# EAGLE design max660-inverter (EAGLE 7.1.0)
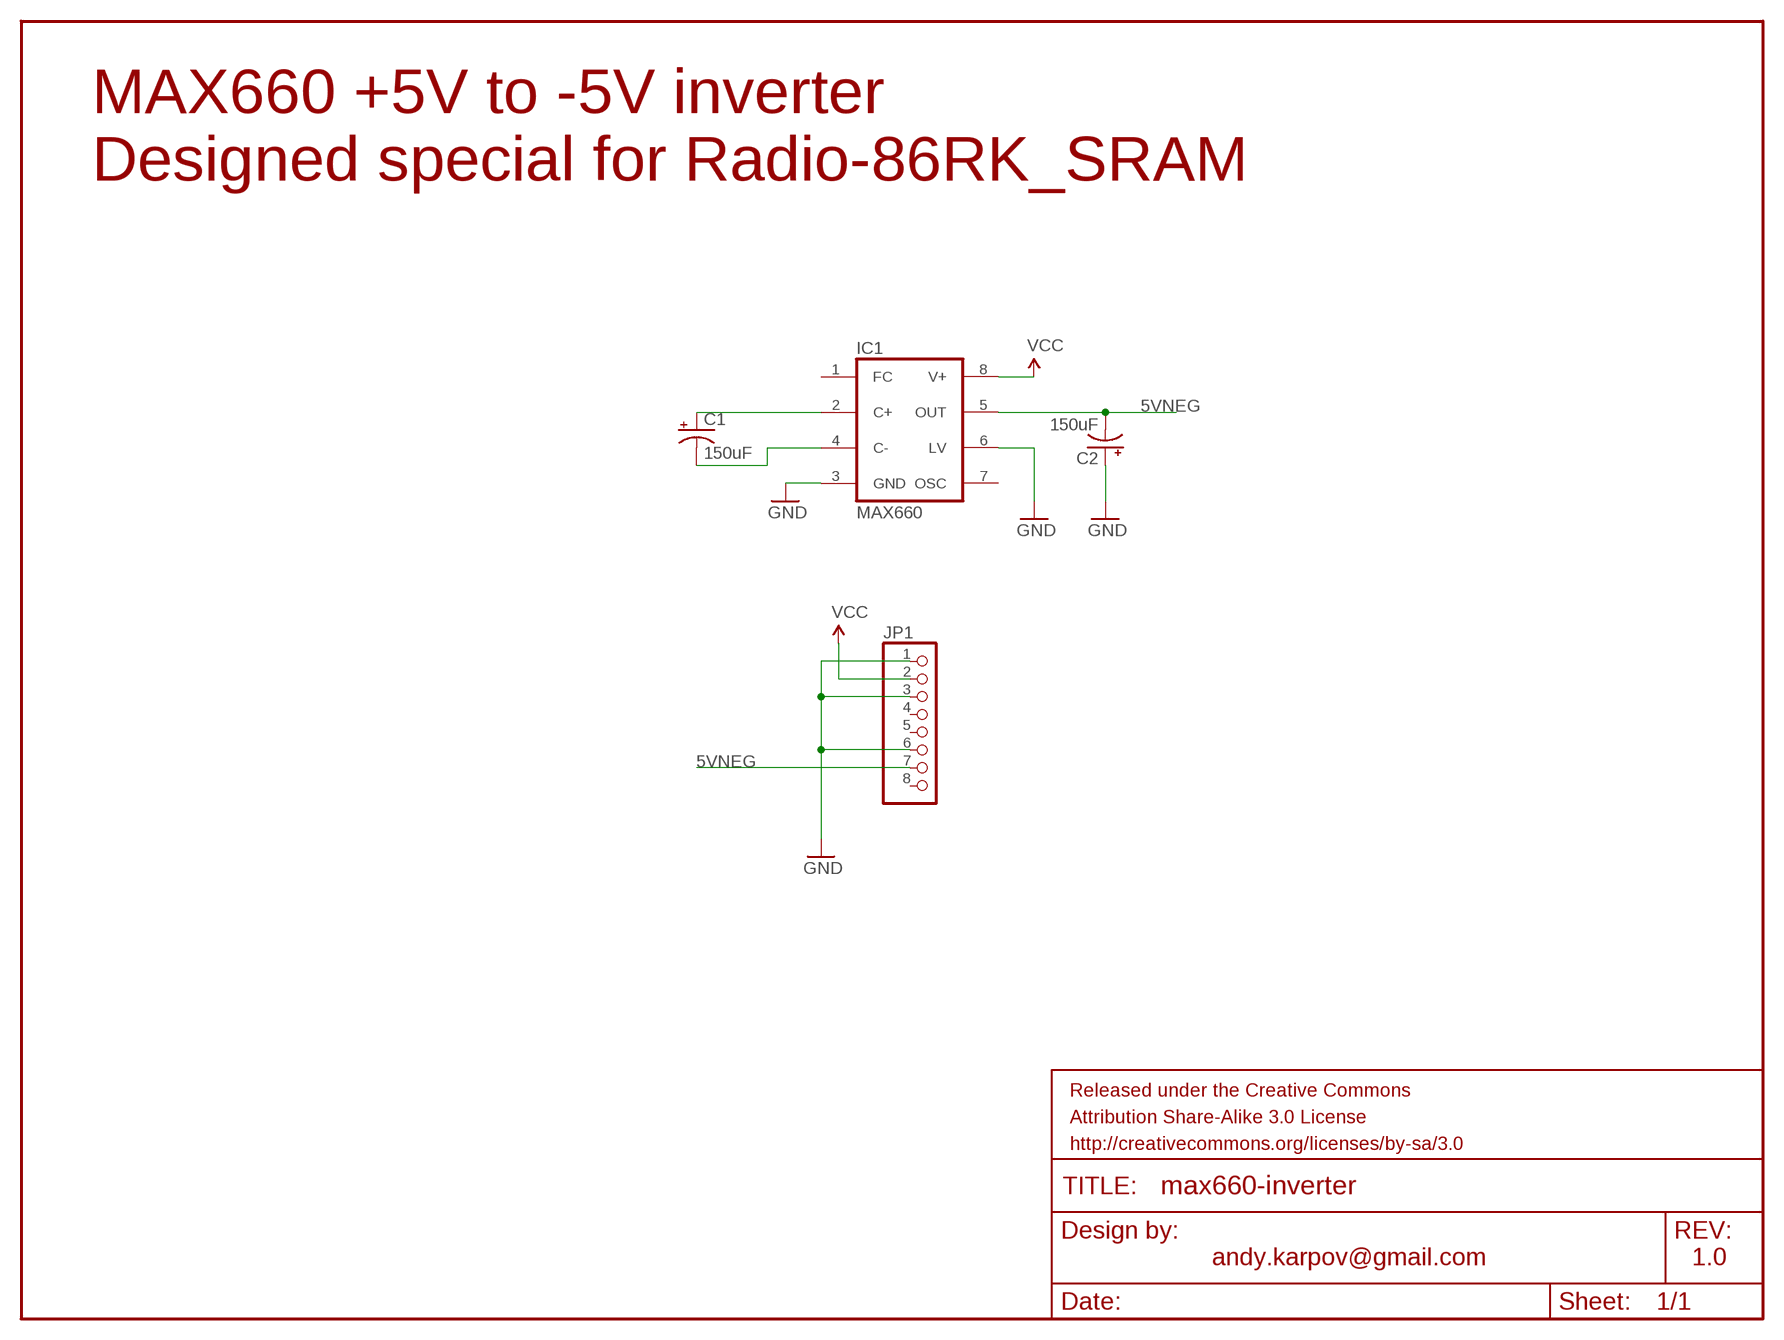
[diagram p0: schematic, sheet 1]

## Parts
C1  150uF  CAP_POLD  [PANASONIC_D]
C2  150uF  CAP_POLD  [PANASONIC_D]
FRAME1  FRAME-LETTER  [CREATIVE_COMMONS]
IC1  MAX660  MAX660CSA  [SO08]
JP1  PINHD-1X8  [1X08]

## Nets
5VNEG: C2.- IC1.5(OUT) JP1.7
GND: C2.+ IC1.3(GND) IC1.6(LV) JP1.1 JP1.3 JP1.6
N$1: C1.- IC1.4(C-)
N$2: C1.+ IC1.2(C+)
VCC: IC1.8(V+) JP1.2
Unconnected: IC1.1(FC) IC1.7(OSC) JP1.4 JP1.5 JP1.8

## Notes on the sheet
- MAX660 +5V to -5V inverter
  Designed special for Radio-86RK_SRAM
- andy.karpov@gmail.com | 1.0

## Library data of the parts
C1 C2 = SparkFun-Capacitors:CAP_POL: Capacitor Polarized These are standard SMD and PTH capacitors. Normally 10uF, 47uF, and 100uF in electrolytic and tantalum varieties. Always verify the external diameter of the through hole cap, it varies with capacity, voltage, and manufacturer. The EIA devices should be standard.
FRAME1 = SparkFun-Aesthetics:FRAME-LETTER: Schematic Frame Standard 8.5x11 US Letter frame
IC1 = maxim-8:MAX660*: Charge-pump VOLTAGE CONVERTER
JP1 = pinhead:PINHD-1X8: PIN HEADER

## Board
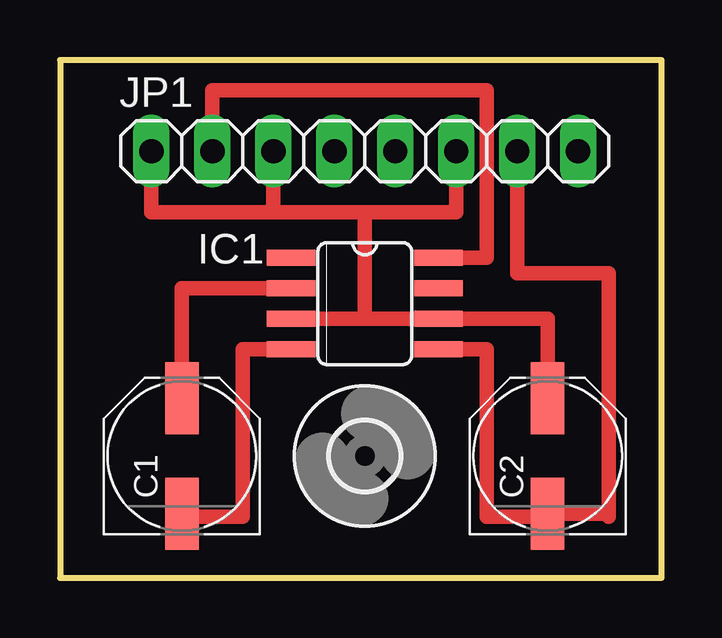
[diagram p1: board, top side]

Size 25.07 x 21.58 mm. Coordinates in mm from the lower left corner, seen from the top.
Outline: 0,0 25.07,0 25.07,21.58 0,21.58 0,0
Copper layers (1*16): Top 0.035mm / dielectric 1.5mm / Bottom 0.035mm
Design rules "default": minimum track width 10mil, minimum drill 24mil, track to track 8mil, track to pad 8mil, pad to pad 8mil, via to via 8mil, smd to smd 8mil, copper to edge 40mil, drill to drill 8mil, minimum pad ring 10mil, minimum via ring 8mil, stop-mask expansion 4mil, vias tented up to drill 0mil, thermal gap 10mil

### Footprints (pad centres in the part's own frame; a part is rotated, then mirrored left to right if it is on the bottom)
PANASONIC_D = smd 3 x 1.4: + 2.4,0; - -2.4,0
SO08 = smd 0.66 x 2.032: 1 -1.905,-3.073; 2 -0.635,-3.073; 3 0.635,-3.073; 4 1.905,-3.073; 5 1.905,3.073; 6 0.635,3.073; 7 -0.635,3.073; 8 -1.905,3.073
1X08 = drill 1.016 long: 1 -8.89,0; 2 -6.35,0; 3 -3.81,0; 4 -1.27,0; 5 1.27,0; 6 3.81,0; 7 6.35,0; 8 8.89,0
2,8 = hole 2.8: 0,0

### Placement (x,y rotation side)
C1  5.08,5.08 90 top
C2  20.32,5.08 90 top
FRAME1  20.32,-13.97 0 top  (outside the outline)
IC1  12.7,11.43 270 top
JP1  12.7,17.78 0 top
U$1  [2,8]  12.7,5.08 0 top

### Tracks (layer width: path | path; a pad name or v marks a point on that pad's centre or on a via)
5VNEG
  Top 0.61: IC1.5 17.78,9.53 17.78,2.54 20.32,2.54 C2.- 22.72,2.68 22.86,2.54 22.86,12.7 19.05,12.7 JP1.7
GND
  Top 0.61: C2.+ 20.32,10.79 IC1.6 12.7,10.79 | IC1.3 12.7,10.79 | JP1.6 16.51,15.24 12.7,15.24 | 12.7,15.24 12.7,10.79 | JP1.3 8.89,15.24 | 8.89,15.24 12.7,15.24 | JP1.1 3.81,15.24 8.89,15.24
N$1
  Top 0.61: IC1.4 7.62,9.53 7.62,2.54 5.08,2.54 C1.-
N$2
  Top 0.61: IC1.2 5.08,12.06 C1.+
VCC
  Top 0.61: JP1.2 6.35,20.32 17.78,20.32 17.78,13.34 IC1.8